# EAGLE design orienteringsklokke v3 (EAGLE 6.5.0)

## Sheet 1 of 2
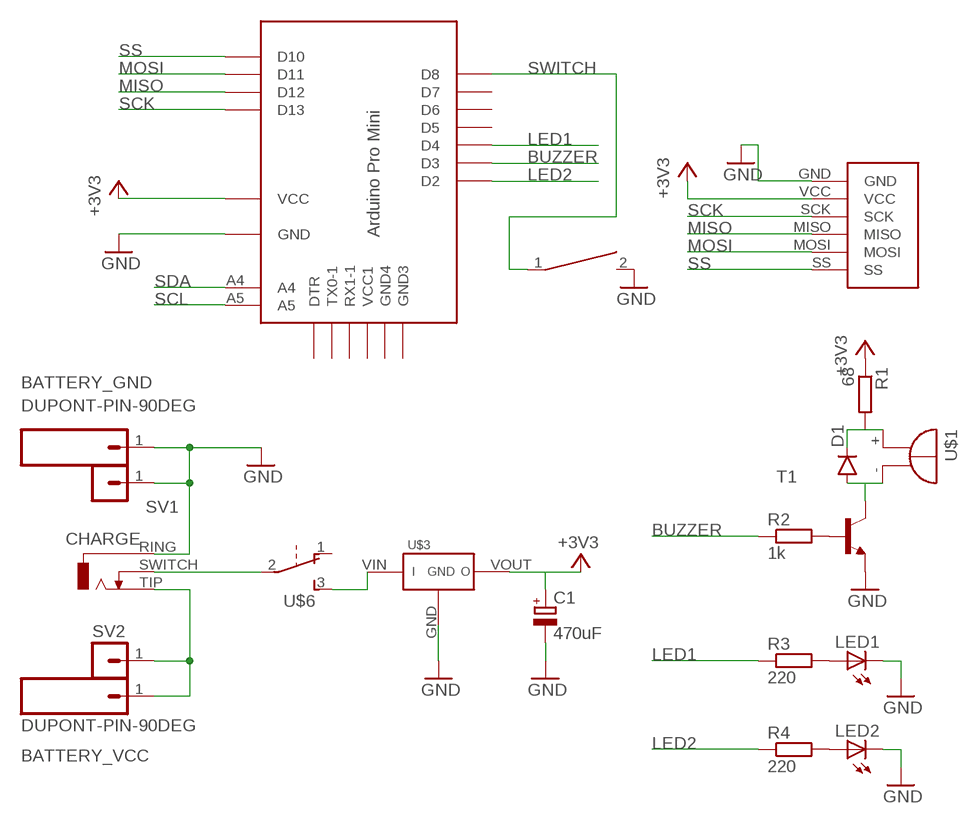
[diagram p0: schematic, sheet 1]

### Parts
BATTERY_GND  DUPONT-PIN-90DEG  [DUPONT-PIN-90DEG]
BATTERY_VCC  DUPONT-PIN-90DEG  [DUPONT-PIN-90DEG]
C1  470uF  CAP-HORIZ  [CAP-HORIZ-6.5X11X2.5]
CHARGE  ST613-JACK  [ST613-JACK]
D1  1N4148DOJ35-5  [DO35-5J]
LED1  LED_J3MM-LEFT  [LED90DEG_LEFT]
LED2  LED_J3MM-LEFT  [LED90DEG_LEFT]
R1  68  R-EU_0204/5  [0204/5]
R2  1k  R-EU_0204/5  [0204/5]
R3  220  R-EU_0204/5  [0204/5]
R4  220  R-EU_0204/5  [0204/5]
SV1  MA01-1JC  [MA01-1J]
SV2  MA01-1JC  [MA01-1J]
T1  2N3904-NPN-TO92-EBC  [TO92-EBC]
U$1  BUZZER_JL  [BUZZER_HORIZ_J_LEFT]
U$2  NFC_MODULE_V3_SPINH  [NFC_MODULE_V3_SPI_CENTERED_NO_HOLES]
U$3  VOLT_BOOST  [VOLT-BOOST]
U$4  ARD-PRO-MINI-ORIENTERING  [ARD_PRO_MINI_ORIENTERING]
U$5  PUSHBUTTON_2P6MM  [PUSHBUTTON_HORIZ_6MM_J]
U$6  SK12D07-SLIDE-SWITCH  [SK12D07]

### Nets
+3V3: C1.+ R1.1 U$2.VCC U$3.VOUT U$4.VCC
BUZZER: R2.1 U$4.D3
GND: BATTERY_GND.1 C1.- CHARGE.RING LED1.K(C) LED2.K(C) SV1.1 T1.E U$2.GND U$3.GND U$4.GND U$5.2
LED1: R3.1 U$4.D4
LED2: R4.1 U$4.D2
MISO: U$2.MISO U$4.D12
MOSI: U$2.MOSI U$4.D11
N$1: CHARGE.SWITCH U$6.2
N$2: D1.A T1.C U$1.-
N$3: R2.2 T1.B
N$4: D1.C R1.2 U$1.+
N$5: LED1.A R3.2
N$6: BATTERY_VCC.1 CHARGE.TIP SV2.1
N$7: U$3.VIN U$6.3
N$8: LED2.A R4.2
SCK: U$2.SCK U$4.D13
SCL: U$4.A5
SDA: U$4.A4
SS: U$2.SS U$4.D10
SWITCH: U$4.D8 U$5.1
Unconnected: U$4.D5 U$4.D6 U$4.D7 U$4.DTR U$4.GND2(GND3) U$4.GND3(GND4) U$4.RX1-1 U$4.TX0-1 U$4.VCC1 U$6.1

## Sheet 2 of 2

## Library data of the parts
BATTERY_GND BATTERY_VCC = joakim:DUPONT-PIN-90DEG
C1 = joakim:CAP-HORIZ
CHARGE = joakim:ST613-JACK
D1 = joakim:1N4148: DIODE high speed (Philips)
LED1 LED2 = joakim:LED_J: LED Everlight: rectangular 2 x 4 mm, 594
R1-R4 = resistor:R-EU_: RESISTOR, European symbol
SV1 SV2 = joakim:MA01-1J: PIN HEADER
T1 = transistor-neu-to92:*-NPN-: NPN Transistror
U$1 = joakim:BUZZER_J
U$2 = joakim:NFC_MODULE_V3_SPI
U$3 = joakim:VOLT_BOOST
U$4 = joakim:ARD-PRO-MINI-ORIENTERING
U$5 = joakim:PUSHBUTTON_2P: Horizontal push button, various shaft lengths. 7.5mm high
U$6 = joakim:SK12D07-SLIDE-SWITCH

## Board
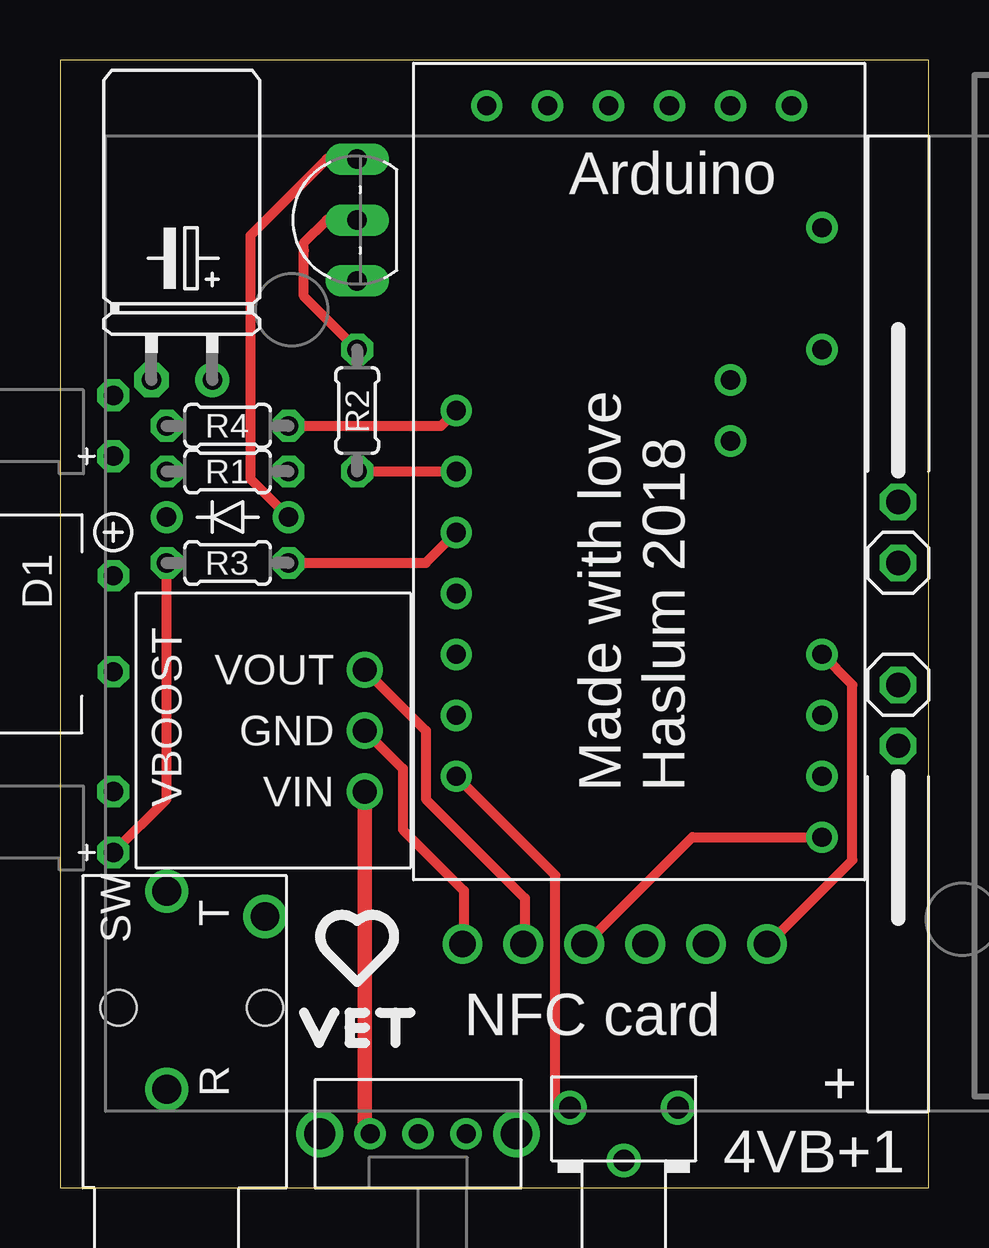
[diagram p1: board, top side]
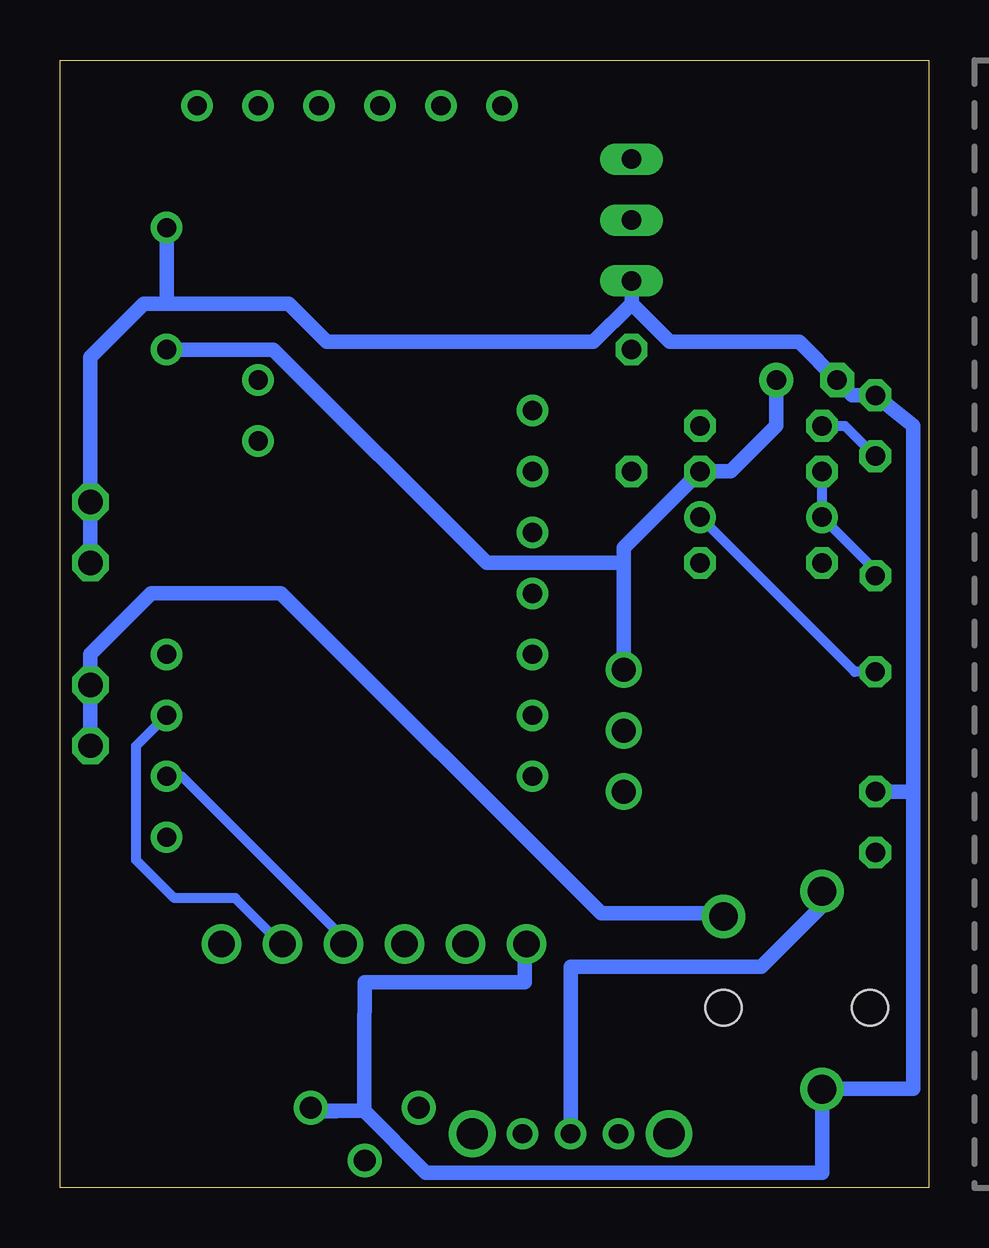
[diagram p2: board, bottom side, seen from below]

Size 36.2 x 46.99 mm. Coordinates in mm from the lower left corner, seen from the top.
Outline: 0,0 36.2,0 36.2,46.99 0,46.99 0,0
Copper layers (1*16): Top 0.035mm / dielectric 1.5mm / Bottom 0.035mm
Design rules "dirt_cheap_dirty_boards.v1.1-eagle5-7": minimum track width 6mil, minimum drill 12mil, track to track 6mil, track to pad 6mil, pad to pad 6mil, via to via 6mil, smd to smd 0mil, copper to edge 10mil, drill to drill 10mil, minimum pad ring 10mil, minimum via ring 6mil, stop-mask expansion 2mil, vias tented up to drill 25mil, thermal gap 10mil

### Footprints (pad centres in the part's own frame; a part is rotated, then mirrored left to right if it is on the bottom)
DUPONT-PIN-90DEG = drill 1.016 octagon: 1 0,0
CAP-HORIZ-6.5X11X2.5 = drill 0.813 pad 1.422: + 0,-1.27 | drill 0.813 pad 1.422 octagon: - 0,1.27
ST613-JACK = drill 1.2: RING 4.1,0; SWITCH 12.35,0; TIP 11.3,-4.1 | hole 1.5: 7.5,2; 7.5,-4.1
DO35-5J = drill 0.813: A 2.54,0; C -2.54,0
LED90DEG_LEFT = drill 0.813 octagon: A -1.27,0; K 1.27,0
0204/5 = drill 0.813 octagon: 1 -2.54,0; 2 2.54,0
MA01-1J = drill 1.016 octagon: 1 0,0
TO92-EBC = drill 0.813 long: B 0,-1.27; C 2.54,-1.27; E -2.54,-1.27
BUZZER_HORIZ_J_LEFT = drill 0.8 octagon: + 2,-5.715; - -2,-5.715
NFC_MODULE_V3_SPI_CENTERED_NO_HOLES = drill 1.1: GND 6.731,13.335; MISO -3.429,13.335; MOSI -0.889,13.335; SCK -5.969,13.335; SS 1.651,13.335; VCC 4.191,13.335
VOLT-BOOST = drill 1: GND 0,0; VIN -2.54,0; VOUT 2.54,0
ARD_PRO_MINI_ORIENTERING = drill 0.8: A4 3.81,1.27; A5 3.81,3.81; D2 -7.62,2.54; D3 -7.62,0; D4 -7.62,-2.54; D5 -7.62,-5.08; D6 -7.62,-7.62; D7 -7.62,-10.16; D8 -7.62,-12.7; D10 7.62,-15.24; D11 7.62,-12.7; D12 7.62,-10.16; D13 7.62,-7.62; DTR 6.35,15.24; GND 7.62,10.16; GND2 -6.35,15.24; GND3 -3.81,15.24; RX1-1 1.27,15.24; TX0-1 3.81,15.24; VCC 7.62,5.08; VCC1 -1.27,15.24
PUSHBUTTON_HORIZ_6MM_J = drill 0.9: 1 -2.25,2.7; 2 2.25,2.7; BODY 0,0.5
SK12D07 = drill 0.8: 1 -2,-2.25; 2 0,-2.25; 3 2,-2.25 | drill 1.3 pad 1.7: P$1 -4.1,-2.25; P$2 4.1,-2.25

### Placement (x,y rotation side)
BATTERY_GND  34.92,28.57 180 top
BATTERY_VCC  34.92,18.41 0 top
C1  5.08,33.66 90 top
CHARGE  4.45,0 90 top
D1  6.99,27.94 0 top
LED1  2.22,15.24 90 top
LED2  2.22,31.75 90 top
R1  6.99,29.84 180 top
R2  12.38,32.38 90 top
R3  6.99,26.04 180 top
R4  6.99,31.75 180 top
SV1  34.92,26.04 0 top
SV2  34.92,20.95 0 top
T1  11.11,40.32 90 top
U$1  -3.49,23.5 90 top
U$2  23.5,23.5 180 top
U$3  12.7,19.05 90 top
U$4  24.13,29.84 0 top
U$5  23.5,0.64 0 top
U$6  14.92,0 180 top

### Tracks (layer width: path | path; a pad name or v marks a point on that pad's centre or on a via)
+3V3
  Top 0.406: U$3.VOUT 15.24,19.05 15.24,16.19 19.37,12.06 19.37,10.23 U$2.VCC
  Bottom 0.61: U$3.VOUT 12.7,26.04 | 12.7,26.04 12.7,26.67 R1.1 8.26,29.84 6.35,31.75 C1.+ | U$4.VCC 27.3,34.92 18.41,26.04 12.7,26.04
BUZZER
  Top 0.406: R2.1 U$4.D3
GND
  Top 0.406: U$3.GND 14.29,17.46 14.29,14.92 16.83,12.38 16.83,10.23 U$2.GND
  Bottom 0.61: 0.64,16.51 0.64,31.75 LED2.K 3.17,33.02 C1.- 5.4,35.24 10.79,35.24 12.38,36.83 | 0.64,16.51 0.64,4.13 4.45,4.13 CHARGE.RING 4.45,0.64 20.95,0.64 23.52,3.2 | LED1.K 0.64,16.51 | 31.75,36.83 26.67,36.83 25.08,35.24 13.97,35.24 12.38,36.83 | 12.38,36.83 T1.E | U$4.GND 31.75,36.83 | 31.75,36.83 32.7,36.83 34.92,34.61 BATTERY_GND.1 SV1.1 | 23.52,3.2 25.72,3.17 U$5.2 25.61,3.2 23.52,3.2 | 23.52,3.2 23.52,6 23.5,8.57 16.83,8.57 16.83,10.1 U$2.GND
LED1
  Top 0.406: R3.1 15.24,26.04 U$4.D4
LED2
  Top 0.406: R4.1 15.88,31.75 U$4.D2
MISO
  Bottom 0.406: U$2.MISO 26.99,10.16 28.89,12.06 31.43,12.06 33.02,13.65 33.02,18.41 U$4.D12
MOSI
  Bottom 0.406: U$2.MOSI 24.38,10.41 31.11,17.14 U$4.D11
N$1
  Bottom 0.61: U$6.2 14.92,9.21 6.99,9.21 4.45,11.75 4.48,12.38 CHARGE.SWITCH
N$2
  Top 0.406: D1.A 7.94,29.53 7.94,39.69 11.11,42.86 T1.C
  Bottom 0.406: U$1.- 3.08,21.5 D1.A
N$3
  Top 0.406: R2.2 10.16,37.15 10.16,39.05 10.16,39.37 11.11,40.32 T1.B
N$4
  Bottom 0.406: U$1.+ 2.32,25.81 D1.C R1.2
N$5
  Top 0.406: LED1.A 4.45,16.19 R3.2
N$6
  Bottom 0.61: BATTERY_VCC.1 SV2.1 34.92,22.23 32.38,24.77 26.99,24.77 13.65,11.43 8.68,11.43 CHARGE.TIP
N$7
  Top 0.61: U$3.VIN 12.7,2.47 U$6.3
N$8
  Bottom 0.406: R4.2 3.49,31.75 LED2.A
SCK
  Top 0.406: U$2.SCK 29.53,10.16 33.02,13.65 33.02,20.95 U$4.D13
SS
  Top 0.406: U$2.SS 21.91,10.16 26.35,14.61 U$4.D10
SWITCH
  Top 0.406: U$5.1 21.25,2.88 20.64,3.49 20.64,13.02 U$4.D8

### Text on the board
tNames: Arduino | Made with love / Haslum 2018 | NFC card | + | 4VB+1